# EasyEDA Pro project Program_Counter.eprj

# Schematic Schematic1
Board Name: Board1; Create Date: 2025-08-16; Page Name: P1; Project Name: Program_Counter; Schematic Name: Schematic1; Update Date: 2025-08-16; Company: EasyEDA.com; Page Size: A4; Version: V1.0
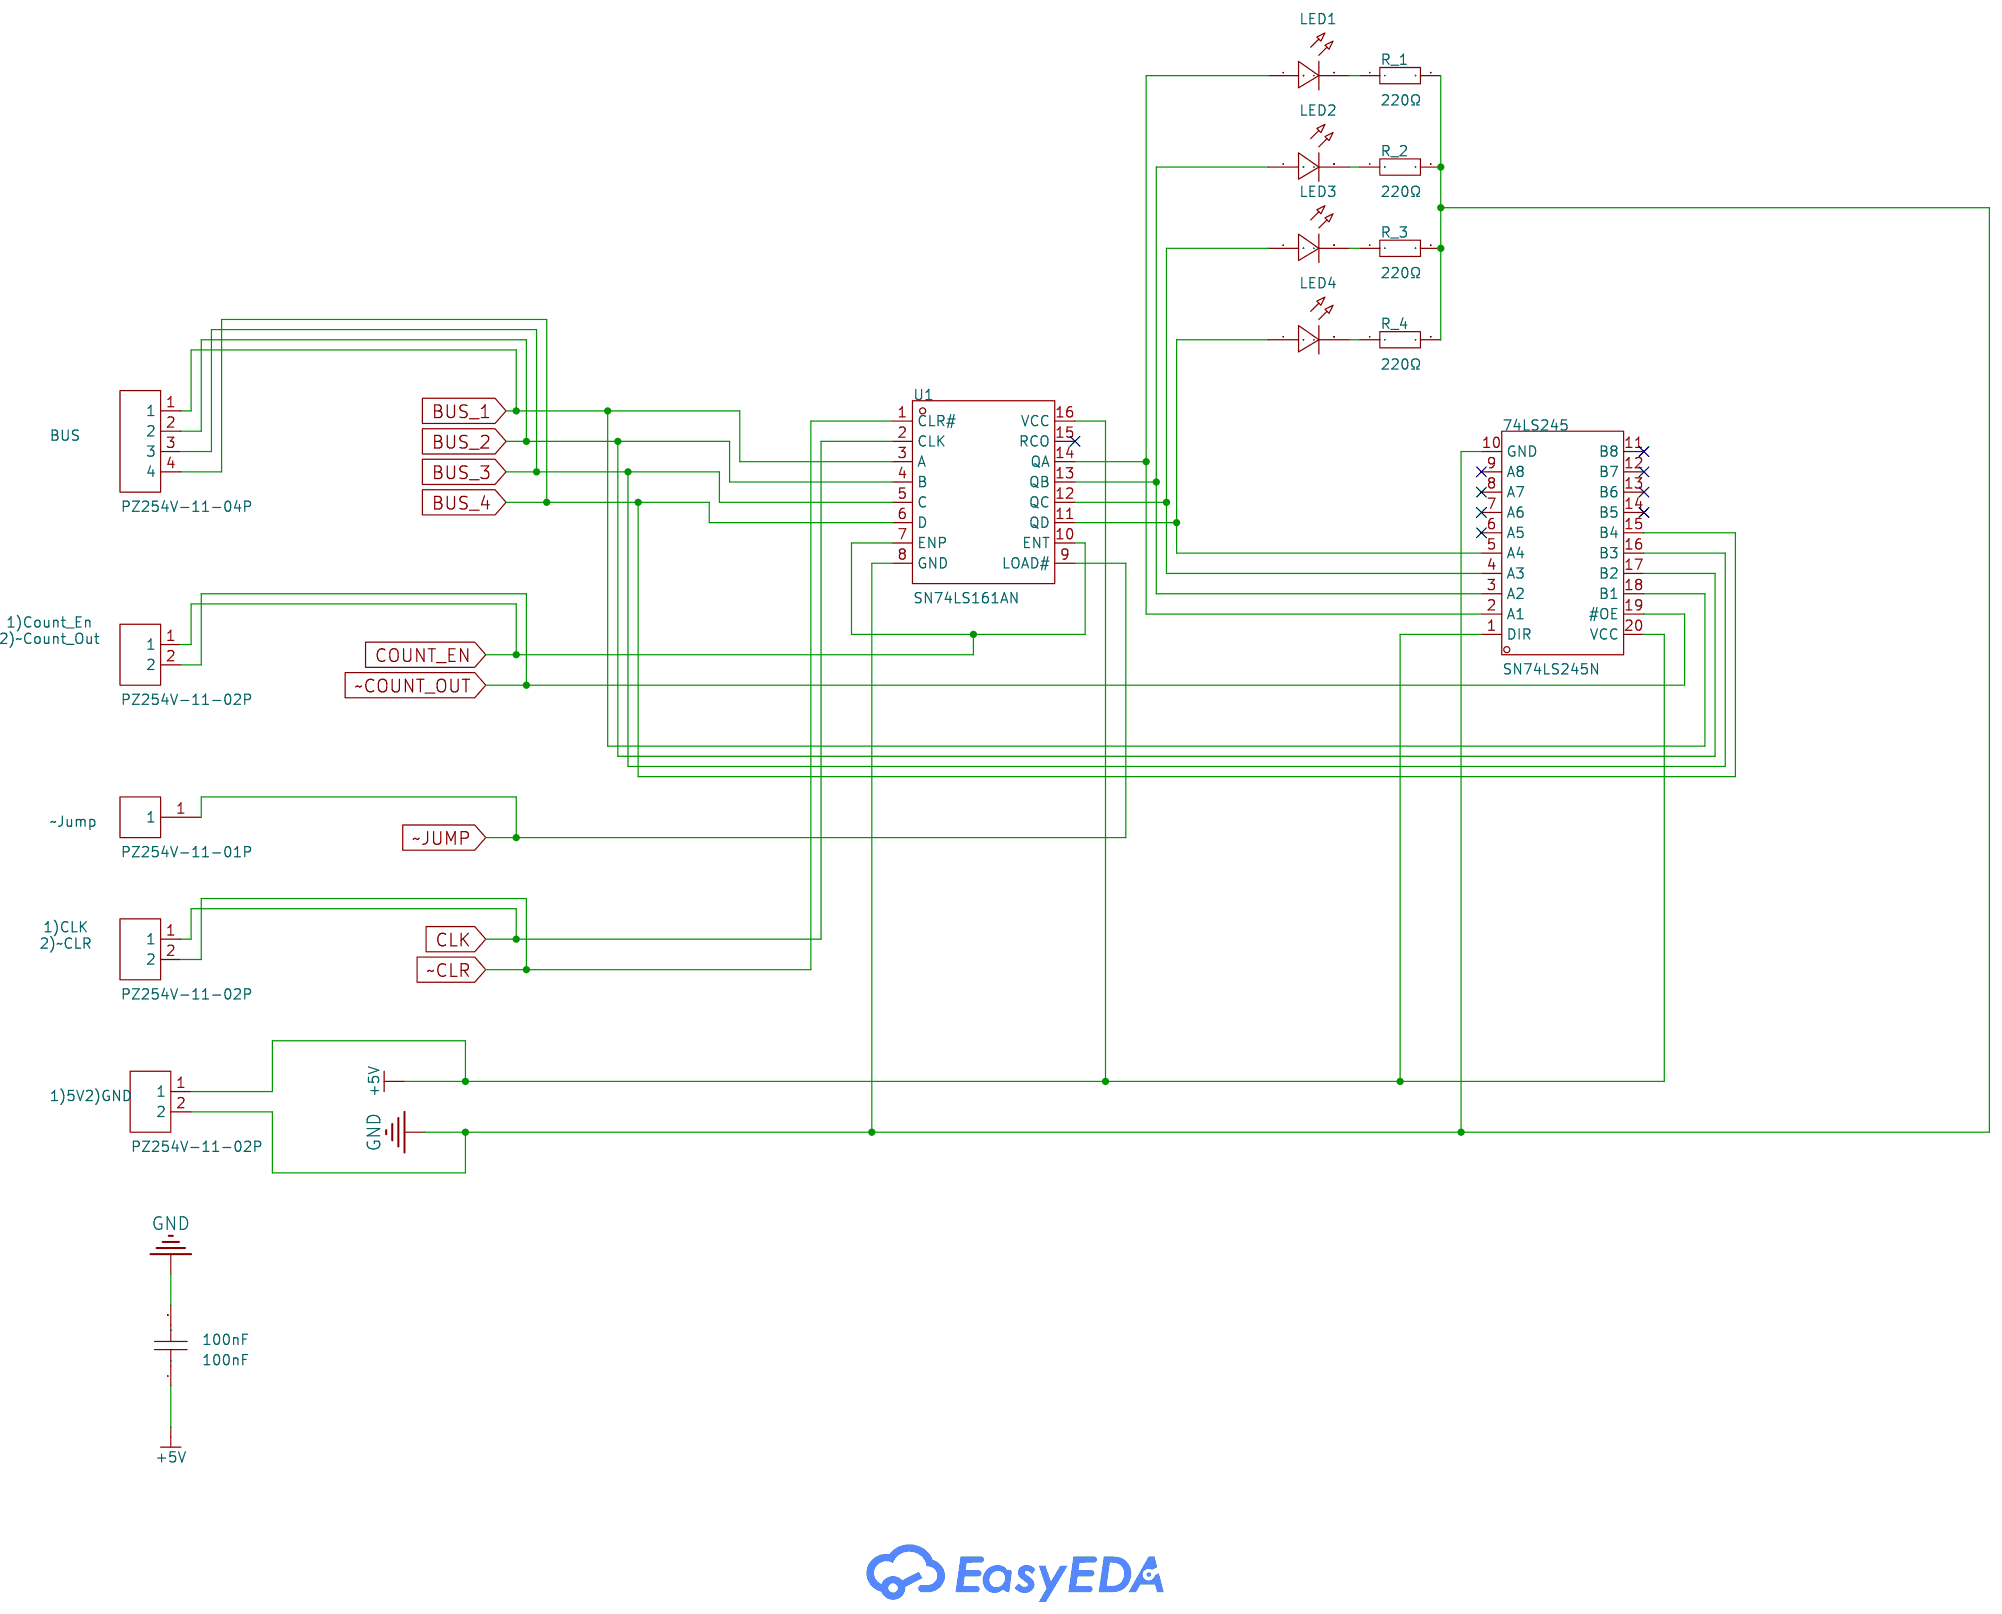
[diagram p0: schematic sheet]

## Parts
1)5V2)GND  PZ254V-11-02P  [HDR-TH_2P-P2.54-V-M]
1)CLK
2)~CLR  PZ254V-11-02P  [HDR-TH_2P-P2.54-V-M]
1)Count_En
2)~Count_Out  PZ254V-11-02P  [HDR-TH_2P-P2.54-V-M]
74LS245  SN74LS245N  [DIP-20_L25.5-W10.0-P2.54-LS7.6-BL]
100nF  100nF  [CAP-TH_L8.5-W5.0-P5.00-D1.2]
BUS  PZ254V-11-04P  [HDR-TH_4P-P2.54-V-M]
LED1  -  [LED-TH_BD5.8-P2.54-FD]
LED2  -  [LED-TH_BD5.8-P2.54-FD]
LED3  -  [LED-TH_BD5.8-P2.54-FD]
LED4  -  [LED-TH_BD5.8-P2.54-FD]
R_1  220Ω  [R_AXIAL-0.4]
R_2  220Ω  [R_AXIAL-0.4]
R_3  220Ω  [R_AXIAL-0.4]
R_4  220Ω  [R_AXIAL-0.4]
U1  SN74LS161AN  [PDIP-16_L19.3-W6.4-P2.54-LS7.9-BL]
~Jump  PZ254V-11-01P  [HDR-TH_1P-P2.54-V-M]

## Library data of the parts
1)5V2)GND 1)CLK
2)~CLR 1)Count_En
2)~Count_Out = PZ254V-11-02P: Pin Structure:1x2P Pitch:2.54mm Row Spacing:- Circluar Pins/Square Pins:Policy Mounting Type:Straight Number of Rows:Single Row Number of Pins:2P Current Rating:- Voltage Rating (Max):- Length of Mating Pin:6mm Insulation Height:2.5mm Length of End Connec; LCSC Part Name: 1x2P 间距:2.54mm 方针 直插; Supplier Part: C492401; Manufacturer: XFCN(兴飞); Supplier Footprint: 插件,P=2.54mm; JLCPCB Part Class: Extended Part; Datasheet: https://atta.szlcsc.com/upload/public/pdf/source/20200309/C492401_A812433581A9B211A7FFA413ADDFF0E5.pdf; Supplier: LCSC; Pin Structure: 1x2P; Pitch: 2.54mm; Circluar Pins/Square Pins: Policy; Mounting Type: Straight; Number of Rows: Single Row; Number of Pins: 2P; Length of Mating Pin: 6mm; Insulation Height: 2.5mm; Length of End Connection Pin: 3mm; Contact Material: Brass; Operating Temperature: -40℃~+105℃; Color: Black
74LS245 = SN74LS245N: output type:Tri-State Voltage - Supply:4.75V~5.25V Voltage - Supply:4.75V~5.25V Number of Elements:1 Number of Bits per Element:8 Current - Output Low(IOL):24mA Current - Output High(IOH):15mA Logic Family:74LS Operating Temperature:0℃~+70℃ Operating Temp; Supplier Part: C352966; Manufacturer: TI(德州仪器); Supplier Footprint: DIP-20; JLCPCB Part Class: Extended Part; Datasheet: https://www.ti.com/cn/lit/gpn/sn74ls245; Supplier: LCSC; output type: Tri-State; Voltage - Supply: 4.75V~5.25V; Number of Elements: 1; Number of Bits per Element: 8; Current - Output Low(IOL): 24mA; Current - Output High(IOH): 15mA; Logic Family: 74LS; Operating Temperature: 0℃~+70℃
100nF = CT4-0805B104K500F3: Capacitance:100nF Tolerance:±10% Tolerance:±10% Voltage Rated: Temperature Coefficient:; LCSC Part Name: 100nF ±10% 50V C3型（直脚）; Supplier Part: C84772; Manufacturer: FH(风华); Supplier Footprint: 插件,P=5.08mm; JLCPCB Part Class: Extended Part; Datasheet: https://atta.szlcsc.com/upload/public/pdf/source/20190402/C385200_059806A6312B28FF1421A2413EB641E1.pdf; Supplier: LCSC; Tolerance: ±10%
BUS = PZ254V-11-04P_C492403: Pin Structure:1x4P Pitch:2.54mm Row Spacing:- Circluar Pins/Square Pins:Policy Mounting Type:Straight Number of Rows:Single Row Number of Pins:4P Current Rating:- Voltage Rating (Max):- Length of Mating Pin:6mm Insulation Height:2.5mm Length of End Connec; LCSC Part Name: 1x4P 间距:2.54mm 方针 直插; Supplier Part: C492403; Manufacturer: XFCN(兴飞); Supplier Footprint: 插件,P=2.54mm; JLCPCB Part Class: Extended Part; Datasheet: https://atta.szlcsc.com/upload/public/pdf/source/20200309/C492403_F9F19131791D08044AD4F84F8E751A34.pdf; Supplier: LCSC; Pin Structure: 1x4P; Pitch: 2.54mm; Circluar Pins/Square Pins: Policy; Mounting Type: Straight; Number of Rows: Single Row; Number of Pins: 4P; Length of Mating Pin: 6mm; Insulation Height: 2.5mm; Length of End Connection Pin: 3mm; Contact Material: Brass; Operating Temperature: -40℃~+105℃; Color: Black
LED1-LED4 = LED_TH-R_5mm: Supplier Footprint: Through
R_1-R_4 = Res_AXIAL-1/4W: Supplier Footprint: Through
U1 = SN74LS161AN: Logic Type:Binary Counter Direction:向上计数器 Supply Voltage:4.75V~5.25V Supply Voltage:4.75V~5.25V Number of Elements:1 Number of Bits per Element:4 Trigger Type:Positive Edge Reset Style:异步 Timing mode:Synchronous Count Rate:25MHz Operating Temperature:0℃~+; LCSC Part Name: 25MHz 4位二进制计数器; Supplier Part: C1547960; Manufacturer: TI(德州仪器); Supplier Footprint: PDIP-16; JLCPCB Part Class: Extended Part; Datasheet: https://www.ti.com/cn/lit/gpn/sn74ls161a; Supplier: LCSC; Logic Type: Binary Counter; Direction: 向上计数器; Supply Voltage: 4.75V~5.25V; Number of Elements: 1; Number of Bits per Element: 4; Trigger Type: Positive Edge; Reset Style: 异步; Timing mode: Synchronous; Count Rate: 25MHz; Operating Temperature: 0℃~+70℃
~Jump = PZ254V-11-01P: Pin Structure:1x1P Pitch:2.54mm Row Spacing:- Circluar Pins/Square Pins:Policy Mounting Type:Straight Number of Rows:Single Row Number of Pins:1P Current Rating:- Voltage Rating (Max):- Length of Mating Pin:6mm Insulation Height:2.5mm Length of End Connec; LCSC Part Name: 1x1P 间距:2.54mm 方针 直插; Supplier Part: C492400; Manufacturer: XFCN(兴飞); Supplier Footprint: 插件,P=2.54mm; JLCPCB Part Class: Extended Part; Datasheet: https://atta.szlcsc.com/upload/public/pdf/source/20200309/C492400_46876A5B545F5AE6B8D4A09C46E276E8.pdf; Supplier: LCSC; Pin Structure: 1x1P; Pitch: 2.54mm; Circluar Pins/Square Pins: Policy; Mounting Type: Straight; Number of Rows: Single Row; Number of Pins: 1P; Length of Mating Pin: 6mm; Insulation Height: 2.5mm; Length of End Connection Pin: 3mm; Contact Material: Brass; Operating Temperature: -40℃~+105℃; Color: Black

## Nets
+5V: 1)5V2)GND.1 74LS245.1(DIR) 74LS245.20(VCC) 100nF.1 U1.16(VCC)
GND: 1)5V2)GND.2 74LS245.10(GND) 100nF.2 R_1.2 R_2.2 R_3.2 R_4.2 U1.8(GND)
BUS_1: 74LS245.18(B1) BUS.1 U1.3(A)
BUS_2: 74LS245.17(B2) BUS.2 U1.4(B)
BUS_3: 74LS245.16(B3) BUS.3 U1.5(C)
BUS_4: 74LS245.15(B4) BUS.4 U1.6(D)
CLK: 1)CLK
2)~CLR.1 U1.2(CLK)
COUNT_EN: 1)Count_En
2)~Count_Out.1 U1.7(ENP) U1.10(ENT)
~CLR: 1)CLK
2)~CLR.2 U1.1(CLR#)
~COUNT_OUT: 1)Count_En
2)~Count_Out.2 74LS245.19(#OE)
~JUMP: U1.9(LOAD#) ~Jump.1
$1N843: 74LS245.2(A1) LED1.1(C) U1.14(QA)
$1N844: 74LS245.3(A2) LED2.1(C) U1.13(QB)
$1N845: 74LS245.5(A4) LED4.1(C) U1.11(QD)
$1N846: 74LS245.4(A3) LED3.1(C) U1.12(QC)
$1N847: LED1.2(A) R_1.1
$1N848: LED2.2(A) R_2.1
$1N849: LED3.2(A) R_3.1
$1N850: LED4.2(A) R_4.1

Not connected (* = marked no-connect by the designer): 74LS245 6(A5)* 7(A6)* 8(A7)* 9(A8)* 11(B8)* 12(B7)* 13(B6)* 14(B5)*; U1 15(RCO)*

# Board PCB1
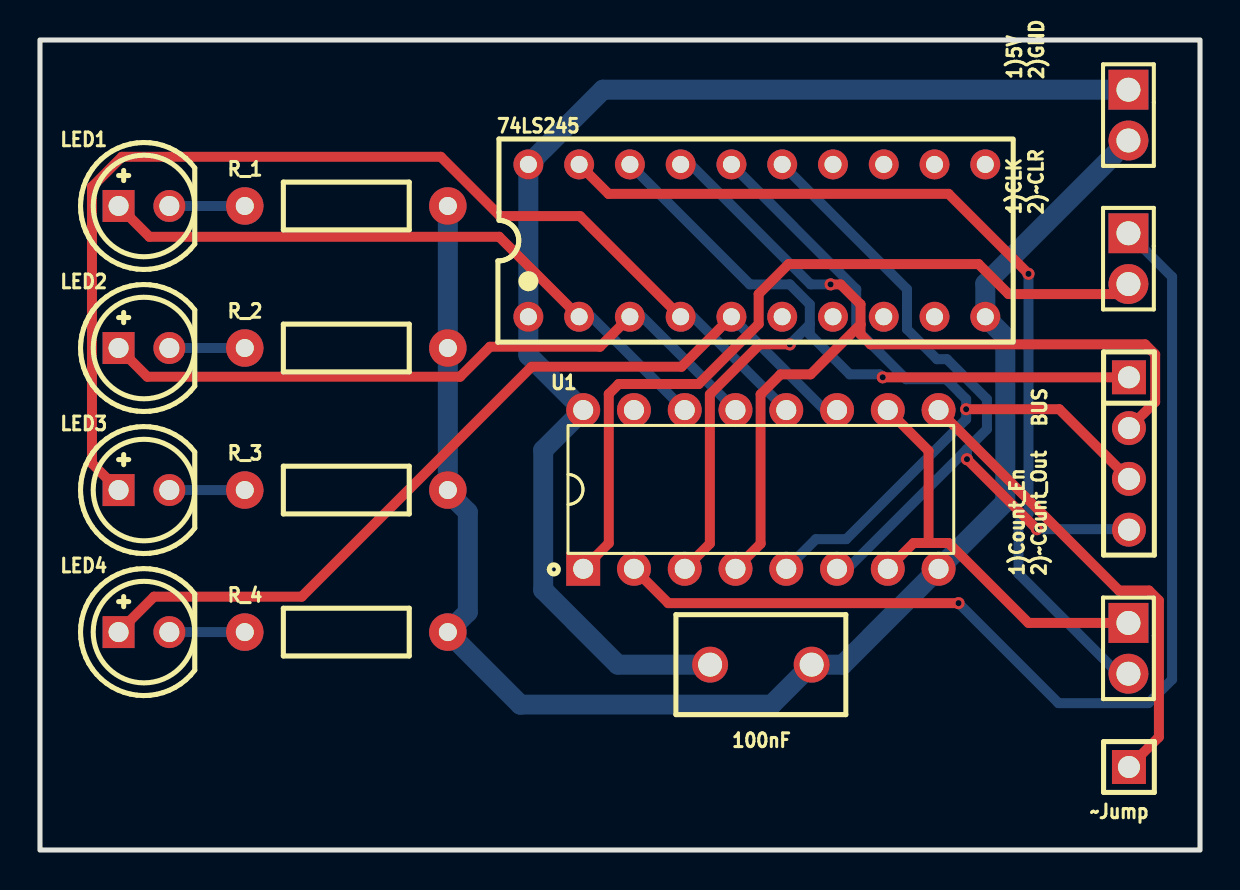
[diagram p1: board, top side]
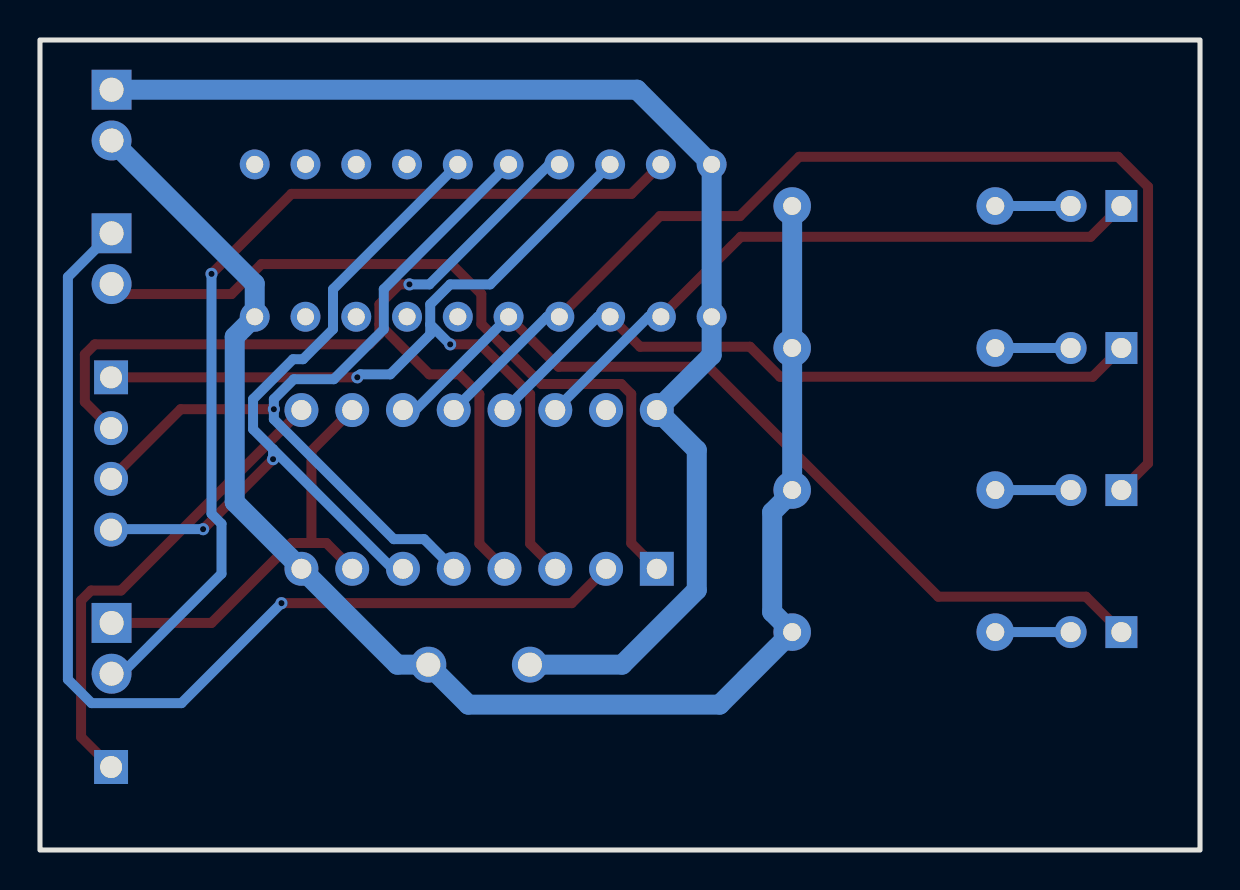
[diagram p2: board, bottom side, seen from below]

Outline 58.04 x 40.51 mm; copper layers: Top Layer, Bottom Layer. Coordinates in mm from the lower left corner of the outline.
Outline path: rectangle 0,40.51 58.04,0
Stack: Top Layer 0.035mm / Dielectric1 1.51mm FR4 er 4.5 / Bottom Layer 0.035mm

## Design rules (mm)
template: Custom Config
spacing copperThickness1oz (default): track to track 0.102, other pairs 0.152 to 0.3
spacing copperThickness2oz: track to track 0.203, other pairs 0.152 to 0.3
track width copperThickness1oz (default): min 0.127, default 0.5, max 2.54
track width copperThickness2oz: min 0.203, default 1, max 2.54
differential pair differentialPair (default): width min 0.127, default 0.254, max 2.54; gap min 0.152, default 0.152
via viaSize (default): diameter min 0.5, default 0.61, max 10; hole min 0.3, default 0.305, max 6.3
net +5V uses copperThickness2oz
net GND uses copperThickness2oz

## Placement (name value [footprint] x y rotation side)
1)5V
2)GND  -  [HDR-TH_2P-P2.54-V-M]  54.46 36.76 270 top
1)CLK
2)~CLR  PZ254V-11-02P  [HDR-TH_2P-P2.54-V-M]  54.46 29.58 270 top
1)Count_En
2)~Count_Out  PZ254V-11-02P  [HDR-TH_2P-P2.54-V-M]  54.46 10.09 270 top
74LS245  SN74LS245N  [DIP-20_L25.5-W10.0-P2.54-LS7.6-BL]  35.86 30.48 0 top
100nF  100nF  [CAP-TH_L8.5-W5.0-P5.00-D1.2]  36.07 9.27 0 top
BUS  PZ254V-11-04P  [HDR-TH_4P-P2.54-V-M]  54.48 19.83 270 top
LED1  -  [LED-TH_BD5.8-P2.54-FD]  5.2 32.21 0 top
LED2  -  [LED-TH_BD5.8-P2.54-FD]  5.2 25.11 0 top
LED3  -  [LED-TH_BD5.8-P2.54-FD]  5.2 18 0 top
LED4  -  [LED-TH_BD5.8-P2.54-FD]  5.2 10.9 0 top
R_1  220Ω  [R_AXIAL-0.4]  15.33 32.21 0 top
R_2  220Ω  [R_AXIAL-0.4]  15.33 25.11 0 top
R_3  220Ω  [R_AXIAL-0.4]  15.33 18 0 top
R_4  220Ω  [R_AXIAL-0.4]  15.33 10.9 0 top
U1  SN74LS161AN  [PDIP-16_L19.3-W6.4-P2.54-LS7.9-BL]  36.07 18.03 0 top
~Jump  PZ254V-11-01P  [HDR-TH_1P-P2.54-V-M]  54.48 4.15 0 top

## Footprints (pads in the part's own frame, mm; a bottom-side part is the same pattern mirrored in y, then rotated)
CAP-TH_L8.5-W5.0-P5.00-D1.2
  round 1.8 hole 1.2: 1(-2.54,0) 2(2.54,0)
DIP-20_L25.5-W10.0-P2.54-LS7.6-BL
  round 1.5 hole 0.85: 1(-11.43,-3.81) 2(-8.89,-3.81) 3(-6.35,-3.81) 4(-3.81,-3.81) 5(-1.27,-3.81) 6(1.27,-3.81) 7(3.81,-3.81) 8(6.35,-3.81) 9(8.89,-3.81) 10(11.43,-3.81) 11(11.43,3.81) 12(8.89,3.81) 13(6.35,3.81) 14(3.81,3.81) 15(1.27,3.81) 16(-1.27,3.81) 17(-3.81,3.81) 18(-6.35,3.81) 19(-8.89,3.81) 20(-11.43,3.81)
HDR-TH_1P-P2.54-V-M
  rect 1.7x1.7 hole 1.1: 1(0,0)
HDR-TH_2P-P2.54-V-M
  rect 2x2 hole 1.2: 1(-1.27,0)
  round 2 hole 1.2: 2(1.27,0)
HDR-TH_4P-P2.54-V-M
  rect 1.7x1.7 hole 1.1: 1(-3.81,0)
  round 1.7 hole 1.1: 2(-1.27,0) 3(1.27,0) 4(3.81,0)
LED-TH_BD5.8-P2.54-FD
  rect 1.6x1.6 hole 1: 1(-1.27,0)
  round 1.6 hole 1: 2(1.27,0)
PDIP-16_L19.3-W6.4-P2.54-LS7.9-BL
  rect 1.7x1.7 hole 1: 1(-8.89,-3.97)
  round 1.7 hole 1: 2(-6.35,-3.97) 3(-3.81,-3.97) 4(-1.27,-3.97) 5(1.27,-3.97) 6(3.81,-3.97) 7(6.35,-3.97) 8(8.89,-3.97) 9(8.89,3.97) 10(6.35,3.97) 11(3.81,3.97) 12(1.27,3.97) 13(-1.27,3.97) 14(-3.81,3.97) 15(-6.35,3.97) 16(-8.89,3.97)
R_AXIAL-0.4
  round 1.879 hole 0.899: 1(-5.08,0) 2(5.08,0)

## Nets
As in the schematic, except:
+5V: 1)5V
2)GND.1 74LS245.1 74LS245.20 100nF.1 U1.16
GND: 1)5V
2)GND.2 74LS245.10 100nF.2 R_1.2 R_2.2 R_3.2 R_4.2 U1.8

Pads without a net: 74LS245 6 7 8 9 11 12 13 14; U1 15

## Via types
v1: diameter 0.61, hole 0.305, Top Layer to Bottom Layer, 8 vias

## Routing (per net, layer and track width the routed paths; a pad name or vN(x,y) marks a point on that pad's centre or on a via; arc(x,y) is an arc through that point)
+5V: length 64.7
  Bottom Layer w1: 1)5V
2)GND.1 28.17,38.03 74LS245.20 74LS245.1 24.43,24.75 U1.16 25.18,20 25.18,13 28.91,9.27 100nF.1
GND: length 77.2
  Bottom Layer w1: 1)5V
2)GND.2 47.3,28.32 74LS245.10 48.3,25.67 48.3,17.4 U1.8 40.17,9.27 100nF.2 36.61,7.27 24.03,7.27 R_4.2 21.41,11.9 21.41,16.9 20.41,17.9 R_2.2 R_1.2
BUS_1: length 46
  Top Layer w0.5: U1.3 33.52,15.32 33.52,22.79 36.02,25.29 v1(37.52,25.29) ; v1(42.16,23.64) BUS.1
  Bottom Layer w0.5: 74LS245.18 35.52,28.29 37.52,28.29 38.52,27.29 38.52,26.29 ; 38.52,26.29 v1(37.52,25.29) ; 38.52,26.29 38.52,25.79 40.52,23.79 42.02,23.79 v1(42.16,23.64)
BUS_2: length 48.5
  Top Layer w0.5: U1.4 36.05,15.32 36.05,22.79 37.05,23.79 38.55,23.79 41.05,26.29 ; 41.05,26.29 41.05,25.79 41.55,25.29 55.29,25.29 55.79,24.79 55.79,22.41 BUS.2 ; 41.05,26.29 41.05,27.29 40.05,28.29 v1(39.55,28.29)
  Bottom Layer w0.5: v1(39.55,28.29) 38.55,28.29 32.55,34.29 74LS245.17
BUS_3: length 40.5
  Top Layer w0.5: v1(46.34,22.05) 51,22.05 BUS.3
  Bottom Layer w0.5: U1.5 38.82,15.55 40.34,15.55 46.34,21.55 v1(46.34,22.05) 46.34,22.55 45.34,23.55 43.34,23.55 40.84,26.05 40.84,28.05 74LS245.16
BUS_4: length 38.2
  Top Layer w0.5: v1(46.38,19.55) v1(49.88,16.05)
  Bottom Layer w0.5: U1.6 40.39,14.06 46.38,20.05 ; v1(49.88,16.05) 54.46,16.05 BUS.4 ; 46.38,20.05 47.38,21.05 47.38,22.55 45.38,24.55 44.88,24.55 43.38,26.05 43.38,28.05 74LS245.15 ; 46.38,20.05 v1(46.38,19.55)
CLK: length 53.4
  Top Layer w0.5: v1(45.96,12.35) 31.44,12.35 U1.2
  Bottom Layer w0.5: v1(45.96,12.35) 50.96,7.35 55.46,7.35 56.64,8.53 56.64,28.66 1)CLK
2)~CLR.1
COUNT_EN: length 21.7
  Top Layer w0.5: 44.46,15.36 45.46,15.36 49.46,11.36 1)Count_En
2)~Count_Out.1 ; 44.46,15.36 43.71,15.36 U1.7 ; 44.46,15.36 44.46,19.96 U1.10
~CLR: length 39.7
  Top Layer w0.5: 1)CLK
2)~CLR.2 53.96,27.81 48.46,27.81 46.96,29.31 37.46,29.31 35.96,27.81 35.96,26.31 32.96,23.31 28.96,23.31 28.46,22.81 28.46,15.34 U1.1
~COUNT_OUT: length 47.5
  Top Layer w0.5: 74LS245.19 28.45,32.82 45.46,32.82 v1(49.46,28.82)
  Bottom Layer w0.5: v1(49.46,28.82) 49.46,16.82 48.96,16.32 48.96,13.82 53.96,8.82 1)Count_En
2)~Count_Out.2
~JUMP: length 23.9
  Top Layer w0.5: ~Jump.1 55.98,5.65 55.98,12.48 55.48,12.98 53.98,12.98 U1.9
$1N843: length 32.6
  Top Layer w0.5: 74LS245.2 22.98,30.67 5.47,30.67 LED1.1
  Bottom Layer w0.5: U1.14 27.59,26.67 74LS245.2
$1N844: length 34.6
  Top Layer w0.5: 74LS245.3 28.02,25.17 22.52,25.17 21.02,23.67 5.37,23.67 LED2.1
  Bottom Layer w0.5: U1.13 30.13,26.67 74LS245.3
$1N845: length 44.4
  Top Layer w0.5: 74LS245.5 32.1,24.17 24.6,24.17 13.1,12.67 5.7,12.67 LED4.1
  Bottom Layer w0.5: 74LS245.5 39.26,22 U1.11
$1N846: length 56.3
  Top Layer w0.5: 74LS245.4 27.02,31.71 23.02,31.71 20.05,34.67 4.1,34.67 2.6,33.17 2.6,19.34 LED3.1
  Bottom Layer w0.5: U1.12 32.67,26.67 74LS245.4
$1N847: length 3.8
  Bottom Layer w0.5: LED1.2 R_1.1
$1N848: length 3.8
  Bottom Layer w0.5: LED2.2 R_2.1
$1N849: length 3.8
  Bottom Layer w0.5: LED3.2 R_3.1
$1N850: length 3.8
  Bottom Layer w0.5: LED4.2 R_4.1
